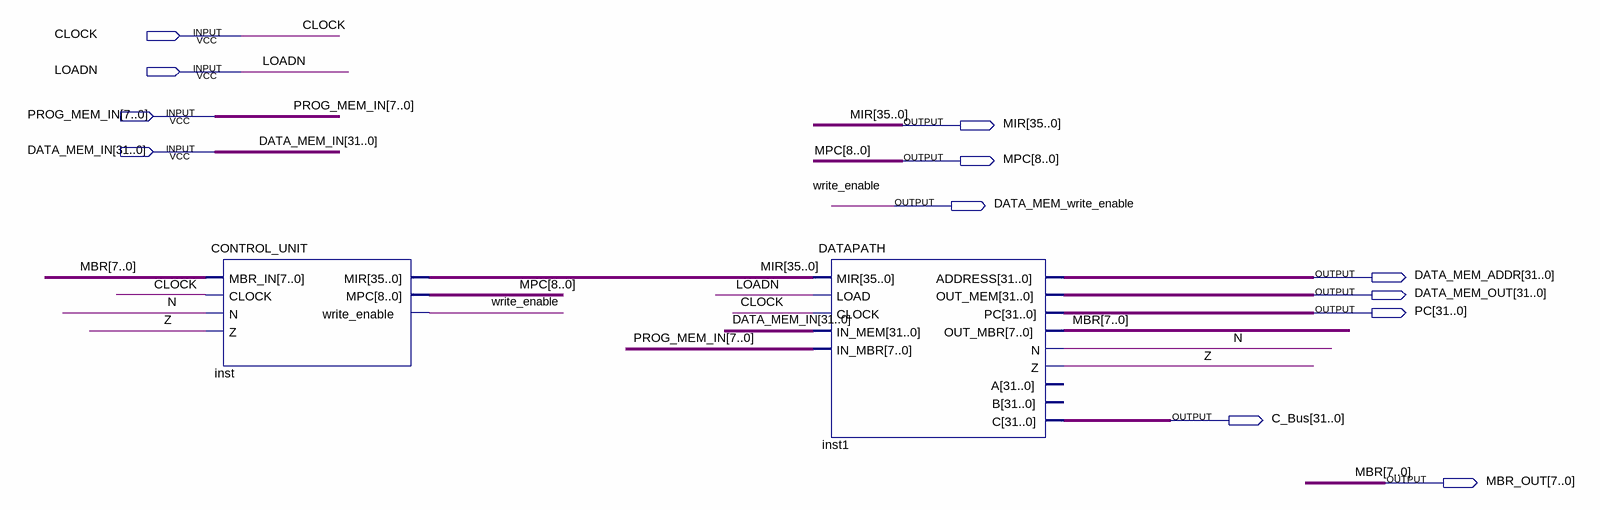
[diagram p0: schematic sheet]
// Quartus schematic CPU.bdf as structural Verilog: 2 symbols, 12 pins
module CPU (
  input  CLOCK,
  input  LOADN,
  input  [7:0] PROG_MEM_IN,
  input  [31:0] DATA_MEM_IN,
  output [35:0] MIR,
  output [8:0] MPC,
  output DATA_MEM_write_enable,
  output [31:0] DATA_MEM_ADDR,
  output [31:0] DATA_MEM_OUT,
  output [31:0] PC,
  output [31:0] C_Bus,
  output [7:0] MBR_OUT
);

  wire N, Z;

  CONTROL_UNIT inst (
    .MBR_IN(MBR_OUT), .CLOCK(CLOCK), .N(N), .Z(Z), .MIR(MIR), .MPC(MPC), .write_enable(DATA_MEM_write_enable));
  DATAPATH inst1 (
    .MIR(MIR), .LOAD(LOADN), .CLOCK(CLOCK), .IN_MEM(DATA_MEM_IN), .IN_MBR(PROG_MEM_IN),
    .ADDRESS(DATA_MEM_ADDR), .OUT_MEM(DATA_MEM_OUT), .PC(PC), .OUT_MBR(MBR_OUT), .N(N), .Z(Z), .C(C_Bus));  // open: A, B

  // Other names for the same wires on the sheet: MBR[7:0] = MBR_OUT; write_enable = DATA_MEM_write_enable
endmodule
